# EAGLE design cheetah_driver_3 (EAGLE 6.5.0)
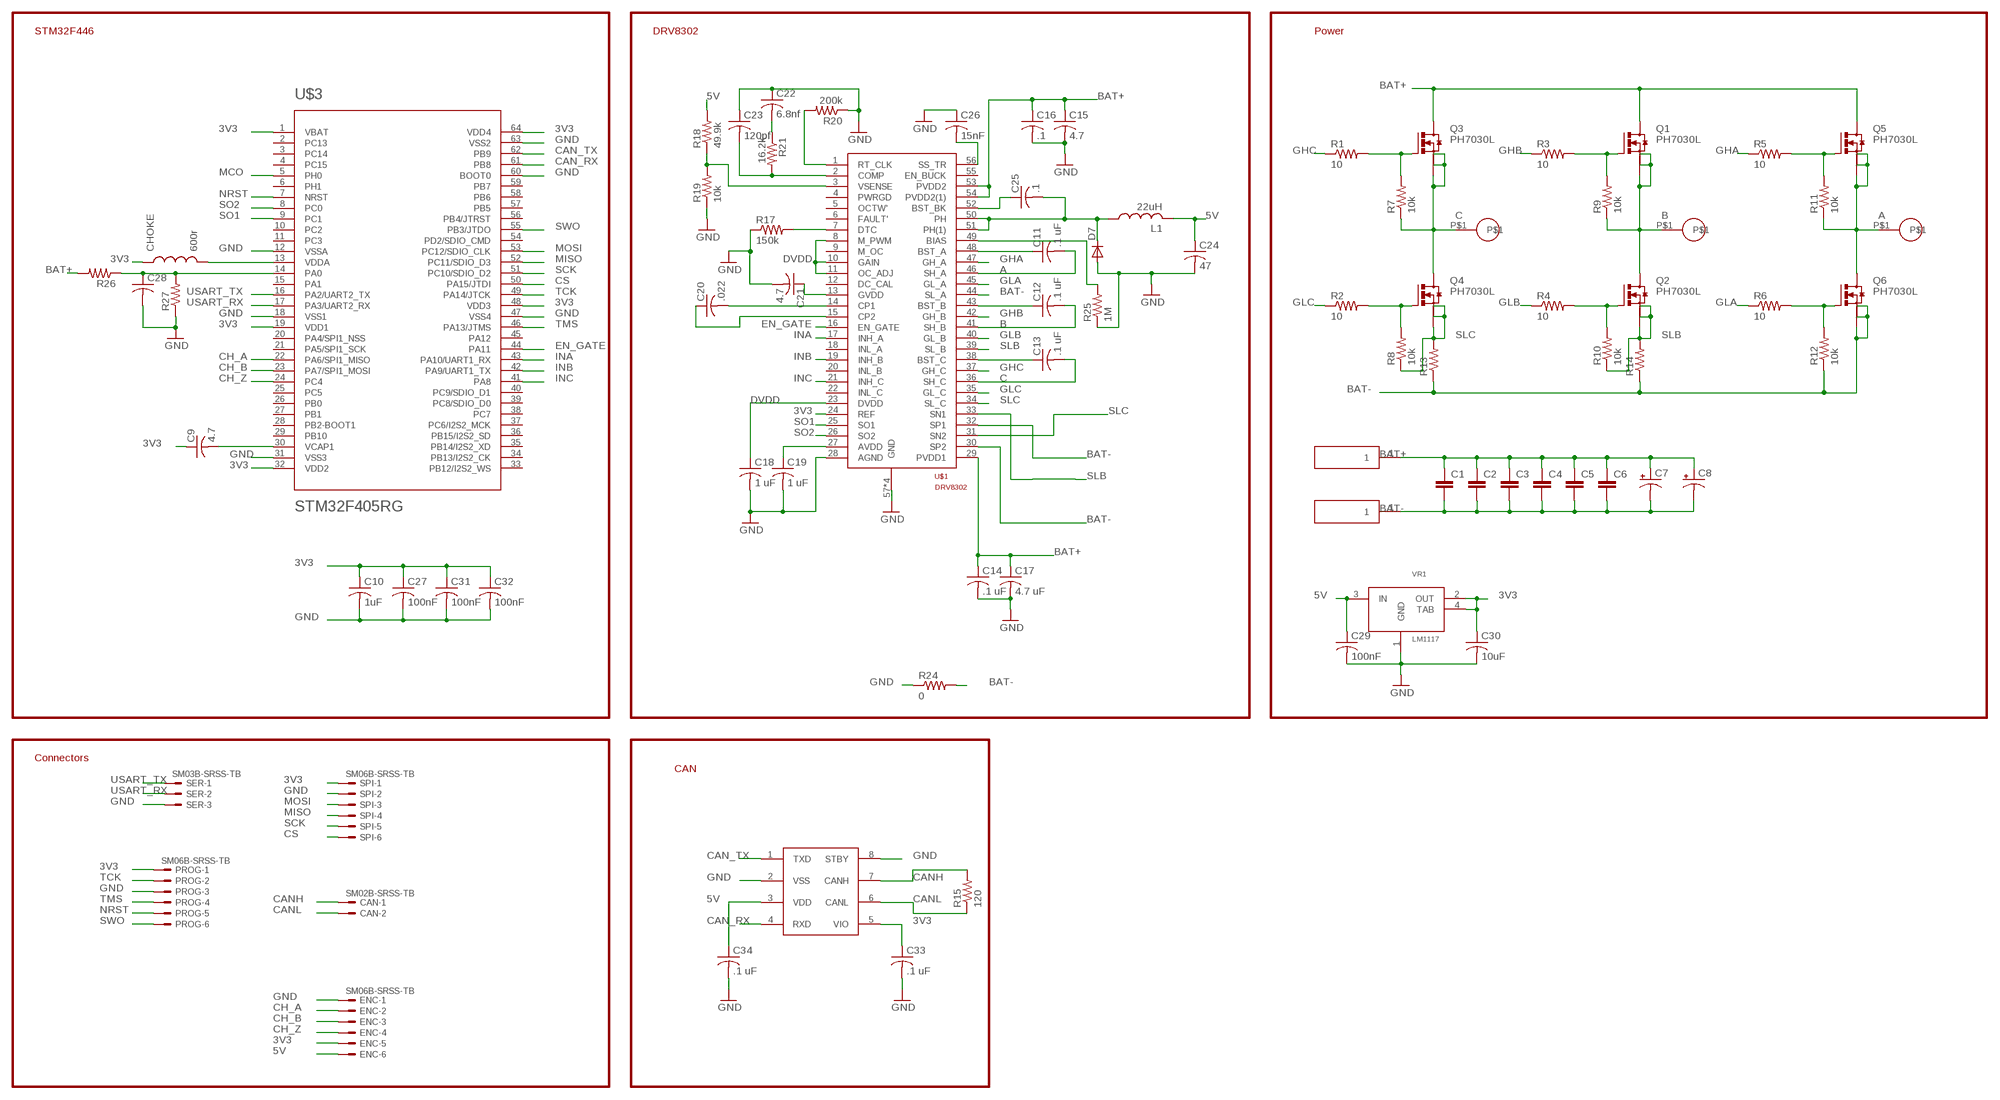
[diagram p0: schematic, sheet 1]

## Parts
C1  C-EUC0805  [C0805]
C2  C-EUC0805  [C0805]
C3  C-EUC0805  [C0805]
C4  C-EUC0805  [C0805]
C5  C-EUC0805  [C0805]
C6  C-EUC0805  [C0805]
C7  CPOL-USE3.5-8  [E3,5-8]
C8  CPOL-USE3.5-8  [E3,5-8]
C9  4.7  C-USC0603  [C0603]
C10  1uF  C-USC0603  [C0603]
C11  .1 uF  C-USC0603  [C0603]
C12  .1 uF  C-USC0603  [C0603]
C13  .1 uF  C-USC0603  [C0603]
C14  .1 uF  C-USC0603  [C0603]
C15  4.7  C-USC0805  [C0805]
C16  .1  C-USC0603  [C0603]
C17  4.7 uF  C-USC0805  [C0805]
C18  1 uF  C-USC0603  [C0603]
C19  1 uF  C-USC0603  [C0603]
C20  .022  C-USC0603  [C0603]
C21  4.7  C-USC0805  [C0805]
C22  6.8nf  C-USC0603  [C0603]
C23  120pf  C-USC0603  [C0603]
C24  47  C-USC1210  [C1210]
C25  .1  C-USC0603  [C0603]
C26  15nF  C-USC0603  [C0603]
C27  100nF  C-USC0603  [C0603]
C28  C-USC0603  [C0603]
C29  100nF  C-USC0603  [C0603]
C30  10uF  C-USC0603  [C0603]
C31  100nF  C-USC0603  [C0603]
C32  100nF  C-USC0603  [C0603]
C33  .1 uF  C-USC0603K  [C0603K]
C34  .1 uF  C-USC0603K  [C0603K]
CAN  SM02B-SRSS-TB  [SM02B-SRSS-TB]
CHOKE  600r  INDUCTOR0603  [0603]
D7  DIODE-DO-214AC  [DO-214AC]
ENC  SM06B-SRSS-TB  [SM06B-SRSS-TB]
J4  0.125_PAD  [0.125_PAD]
J5  0.125_PAD  [0.125_PAD]
L1  22uH  L-USL4532P  [L4532P]
PROG  SM06B-SRSS-TB  [SM06B-SRSS-TB]
Q1  PH7030L  [SOT669]
Q2  PH7030L  [SOT669]
Q3  PH7030L  [SOT669]
Q4  PH7030L  [SOT669]
Q5  PH7030L  [SOT669]
Q6  PH7030L  [SOT669]
R1  10  R-US_R0603  [R0603]
R2  10  R-US_R0603  [R0603]
R3  10  R-US_R0603  [R0603]
R4  10  R-US_R0603  [R0603]
R5  10  R-US_R0603  [R0603]
R6  10  R-US_R0603  [R0603]
R7  10k  R-US_R0603  [R0603]
R8  10k  R-US_R0603  [R0603]
R9  10k  R-US_R0603  [R0603]
R10  10k  R-US_R0603  [R0603]
R11  10k  R-US_R0603  [R0603]
R12  10k  R-US_R0603  [R0603]
R13  R-US_R1210  [R1210]
R14  R-US_R1210  [R1210]
R15  120  R-US_R0603  [R0603]
R17  150k  R-US_R0603  [R0603]
R18  49.9k  R-US_R0603  [R0603]
R19  10k  R-US_R0603  [R0603]
R20  200k  R-US_R0603  [R0603]
R21  16.2k  R-US_R0603  [R0603]
R24  0  R-US_R0603  [R0603]
R25  1M  R-US_R0603  [R0603]
R26  R-US_R0603  [R0603]
R27  R-US_R0603  [R0603]
SER  SM03B-SRSS-TB  [SM03B-SRSS-TB]
SPI  SM06B-SRSS-TB  [SM06B-SRSS-TB]
U$1  DRV8302  [HTSSOP56]
U$2  18_AWG_PAD  [18_AWG_PAD]
U$3  STM32F405RG  [TQFP64]
U$4  18_AWG_PAD  [18_AWG_PAD]
U$5  18_AWG_PAD  [18_AWG_PAD]
U$6  MCP2561  [SO08]
VR1  LM1117  [SOT-223]

## Nets
3V3: C9.1 C10.1 C27.1 C30.1 C31.1 C32.1 C33.1 CHOKE.1 ENC.5 PROG.1 SPI.1 U$1.24(REF) U$3.1(VBAT) U$3.19(VDD1) U$3.32(VDD2) U$3.48(VDD3) U$3.64(VDD4) U$6.5(VIO) VR1.2(OUT) VR1.4(TAB)
5V: C24.1 C29.1 C34.1 ENC.6 L1.2 R18.2 U$6.3(VDD) VR1.3(IN)
A: C11.2 Q5.1(S) Q5.2(S) Q5.3(S) Q6.MB(D) R11.1 U$1.46(SH_A) U$5.P$1
B: C12.2 Q1.1(S) Q1.2(S) Q1.3(S) Q2.MB(D) R9.1 U$1.41(SH_B) U$4.P$1
BAT+: C1.1 C2.1 C3.1 C4.1 C5.1 C6.1 C7.+ C8.+ C14.1 C15.1 C16.1 C17.1 J4.1 Q1.MB(D) Q3.MB(D) Q5.MB(D) R26.2 U$1.29(PVDD1) U$1.53(PVDD2) U$1.54(PVDD2(1))
BAT-: C1.2 C2.2 C3.2 C4.2 C5.2 C6.2 C7.- C8.- J5.1 Q6.1(S) Q6.2(S) Q6.3(S) R12.1 R13.1 R14.1 R24.2 U$1.30(SP2) U$1.32(SP1) U$1.44(SL_A)
C: C13.2 Q3.1(S) Q3.2(S) Q3.3(S) Q4.MB(D) R7.1 U$1.36(SH_C) U$2.P$1
CAN_RX: U$3.61(PB8) U$6.4(RXD)
CAN_TX: U$3.62(PB9) U$6.1(TXD)
CANH: CAN.1 R15.2 U$6.7(CANH)
CANL: CAN.2 R15.1 U$6.6(CANL)
CH_A: ENC.2 U$3.22(PA6/SPI1_MISO)
CH_B: ENC.3 U$3.23(PA7/SPI1_MOSI)
CH_Z: ENC.4 U$3.24(PC4)
CS: SPI.6 U$3.50(PA15/JTDI)
DVDD: C18.1 U$1.8(M_PWM) U$1.10(GAIN) U$1.11(OC_ADJ) U$1.23(DVDD)
EN_GATE: U$1.16(EN_GATE) U$3.44(PA11)
GHA: R5.1 U$1.47(GH_A)
GHB: R3.1 U$1.42(GH_B)
GHC: R1.1 U$1.37(GH_C)
GLA: R6.1 U$1.45(GL_A)
GLB: R4.1 U$1.40(GL_B)
GLC: R2.1 U$1.35(GL_C)
GND: C10.2 C14.2 C15.2 C16.2 C17.2 C18.2 C19.2 C21.2 C22.1 C23.1 C24.2 C26.1 C27.2 C28.2 C29.2 C30.2 C31.2 C32.2 C33.2 C34.2 D7.A ENC.1 PROG.3 R17.1 R19.1 R20.1 R24.1 R25.1 R27.1 SER.3 SPI.2 U$1.28(AGND) U$1.57(GND) U$1.P$1(GND) U$1.P$2(GND) U$1.P$3(GND) U$3.12(VSSA) U$3.18(VSS1) U$3.31(VSS3) U$3.47(VSS4) U$3.60(BOOT0) U$3.63(VSS2) U$6.2(VSS) U$6.8(STBY) VR1.1(GND)
INA: U$1.17(INH_A) U$3.43(PA10/UART1_RX)
INB: U$1.19(INH_B) U$3.42(PA9/UART1_TX)
INC: U$1.21(INH_C) U$3.41(PA8)
MCO: U$3.5(PH0)
MISO: SPI.4 U$3.52(PC11/SDIO_D3)
MOSI: SPI.3 U$3.53(PC12/SDIO_CLK)
N$1: Q3.4(G) R1.2 R7.2
N$2: CHOKE.2 U$3.13(VDDA)
N$3: C9.2 U$3.30(VCAP1)
N$4: C11.1 U$1.48(BST_A)
N$5: R25.2 U$1.49(BIAS)
N$6: C13.1 U$1.38(BST_C)
N$7: Q4.4(G) R2.2 R8.2
N$8: Q1.4(G) R3.2 R9.2
N$9: C12.1 U$1.43(BST_B)
N$10: Q5.4(G) R5.2 R11.2
N$11: Q6.4(G) R6.2 R12.2
N$12: R18.1 R19.2 U$1.3(VSENSE)
N$13: R17.2 U$1.7(DTC)
N$14: C19.1 U$1.27(AVDD)
N$15: C20.2 U$1.14(CP1)
N$16: C20.1 U$1.15(CP2)
N$17: C21.1 U$1.13(GVDD)
N$18: C23.2 R21.2 U$1.2(COMP)
N$19: R20.2 U$1.1(RT_CLK)
N$20: C22.2 R21.1
N$21: C25.2 D7.C L1.1 U$1.50(PH) U$1.51(PH(1))
N$22: C25.1 U$1.52(BST_BK)
N$23: C26.2 U$1.56(SS_TR)
N$24: C28.1 R26.1 R27.2 U$3.14(PA0)
N$27: Q2.4(G) R4.2 R10.2
NRST: PROG.5 U$3.7(NRST)
SCK: SPI.5 U$3.51(PC10/SDIO_D2)
SLB: Q2.1(S) Q2.2(S) Q2.3(S) R10.1 R14.2 U$1.33(SN1) U$1.39(SL_B)
SLC: Q4.1(S) Q4.2(S) Q4.3(S) R8.1 R13.2 U$1.31(SN2) U$1.34(SL_C)
SO1: U$1.25(SO1) U$3.9(PC1)
SO2: U$1.26(SO2) U$3.8(PC0)
SWO: PROG.6 U$3.55(PB3/JTDO)
TCK: PROG.2 U$3.49(PA14/JTCK)
TMS: PROG.4 U$3.46(PA13/JTMS)
USART_RX: SER.2 U$3.17(PA3/UART2_RX)
USART_TX: SER.1 U$3.16(PA2/UART2_TX)
Unconnected: U$1.4(PWRGD) U$1.5(OCTW') U$1.6(FAULT') U$1.9(M_OC) U$1.12(DC_CAL) U$1.18(INL_A) U$1.20(INL_B) U$1.22(INL_C) U$1.55(EN_BUCK) U$3.2(PC13) U$3.3(PC14) U$3.4(PC15) U$3.6(PH1) U$3.10(PC2) U$3.11(PC3) U$3.15(PA1) U$3.20(PA4/SPI1_NSS) U$3.21(PA5/SPI1_SCK) U$3.25(PC5) U$3.26(PB0) U$3.27(PB1) U$3.28(PB2-BOOT1) U$3.29(PB10) U$3.33(PB12/I2S2_WS) U$3.34(PB13/I2S2_CK) U$3.35(PB14/I2S2_XD) U$3.36(PB15/I2S2_SD) U$3.37(PC6/I2S2_MCK) U$3.38(PC7) U$3.39(PC8/SDIO_D0) U$3.40(PC9/SDIO_D1) U$3.45(PA12) U$3.54(PD2/SDIO_CMD) U$3.56(PB4/JTRST) U$3.57(PB5) U$3.58(PB6) U$3.59(PB7)

## Notes on the sheet
- STM32F446 | DRV8302 | Power
- Connectors
- CAN

## Library data of the parts
C1-C6 = rcl:C-EU: CAPACITOR, European symbol
C7 C8 = rcl:CPOL-US: POLARIZED CAPACITOR, American symbol
C9-C34 = rcl:C-US: CAPACITOR, American symbol
CAN = con-jst2:?M02B-SRSS-TB: Disconnectable Crimp style connector, 1.0mm pitch 2 contacts
CHOKE = SparkFun-Passives:INDUCTOR: Inductors Basic Inductor/Choke - 0603 and 1206. Footprints are not proven and vary greatly between part numbers. INDUCTOR POWER 3.3UH 4.0A SMD 0.197" L x 0.197" W x 0.177" H (5.00mm x 5.00mm x 4.50mm)
D7 = diode:DIODE-: DIODE
ENC PROG SPI = con-jst2:?M06B-SRSS-TB: Disconnectable Crimp style connector, 1.0mm pitch 6 contacts
J4 J5 = sc_usercreated:0.125_PAD
L1 = rcl:L-US: INDUCTOR, American symbol
Q1-Q6 = transistor-power:PH7030L: N-channel TrenchMOS (TM) logic level FET Source: http://www.nxp.com/acrobat_download/datasheets/PH7030L_4.pdf
R1-R15 R17-R21 R24-R27 = rcl:R-US_: RESISTOR, American symbol
SER = con-jst2:?M03B-SRSS-TB: Disconnectable Crimp style connector, 1.0mm pitch 3 contacts
U$1 = ASL (1):DRV8302
U$2 U$4 U$5 = BenLibrary:18_AWG_PAD
U$3 = BenLibrary:STM32F405RG: ARM DSP Chip used on the WAV Trigger board.
U$6 = BenLibrary:MCP2561
VR1 = sc_usercreated:LM1117

## Board
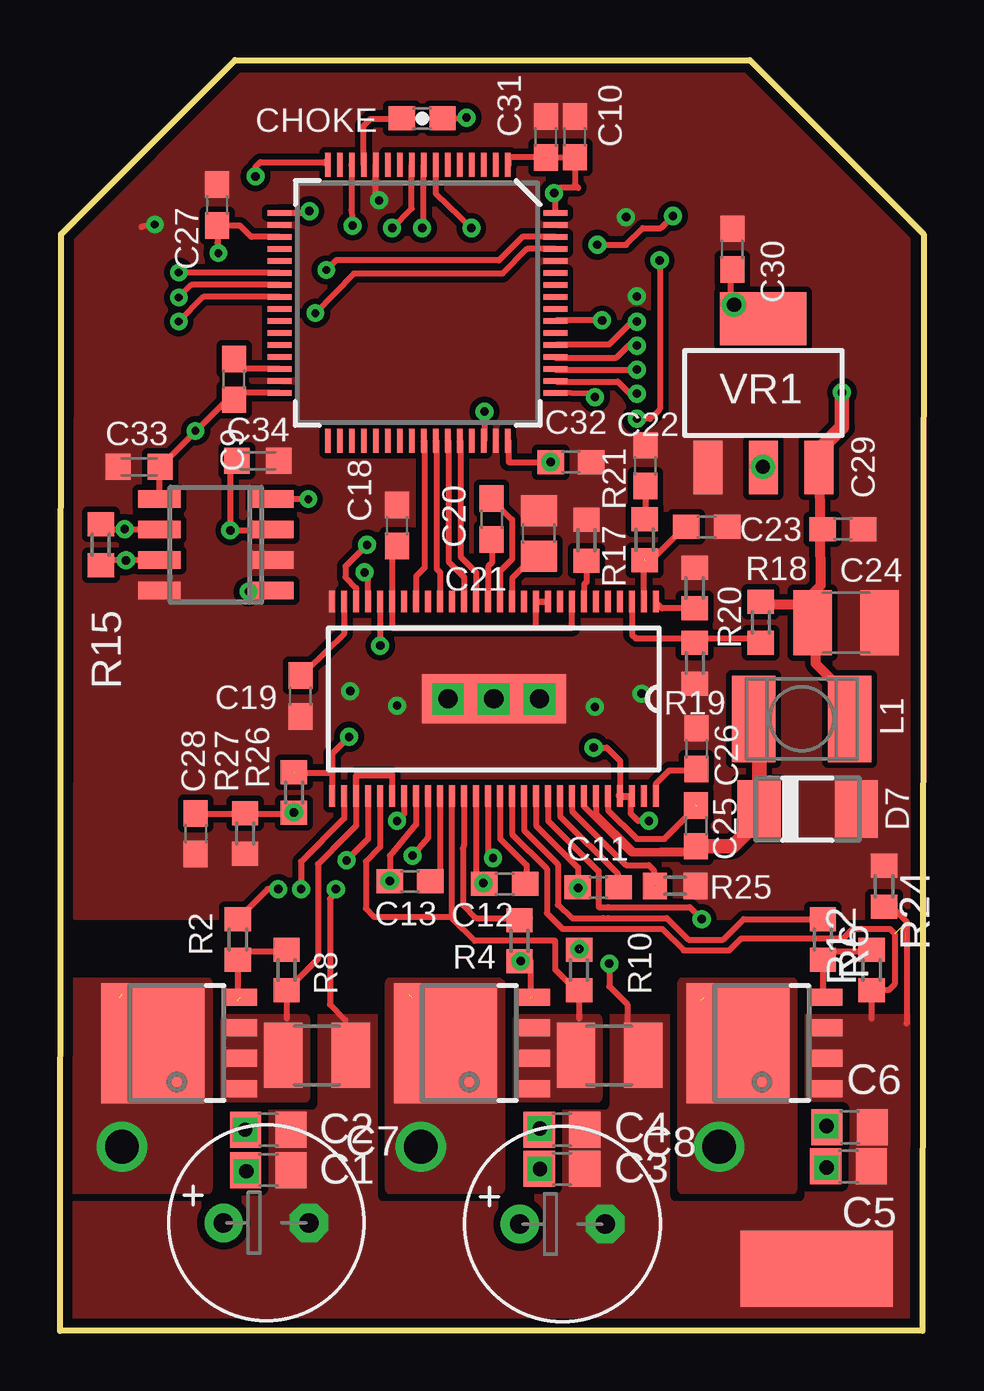
[diagram p1: board, top side]
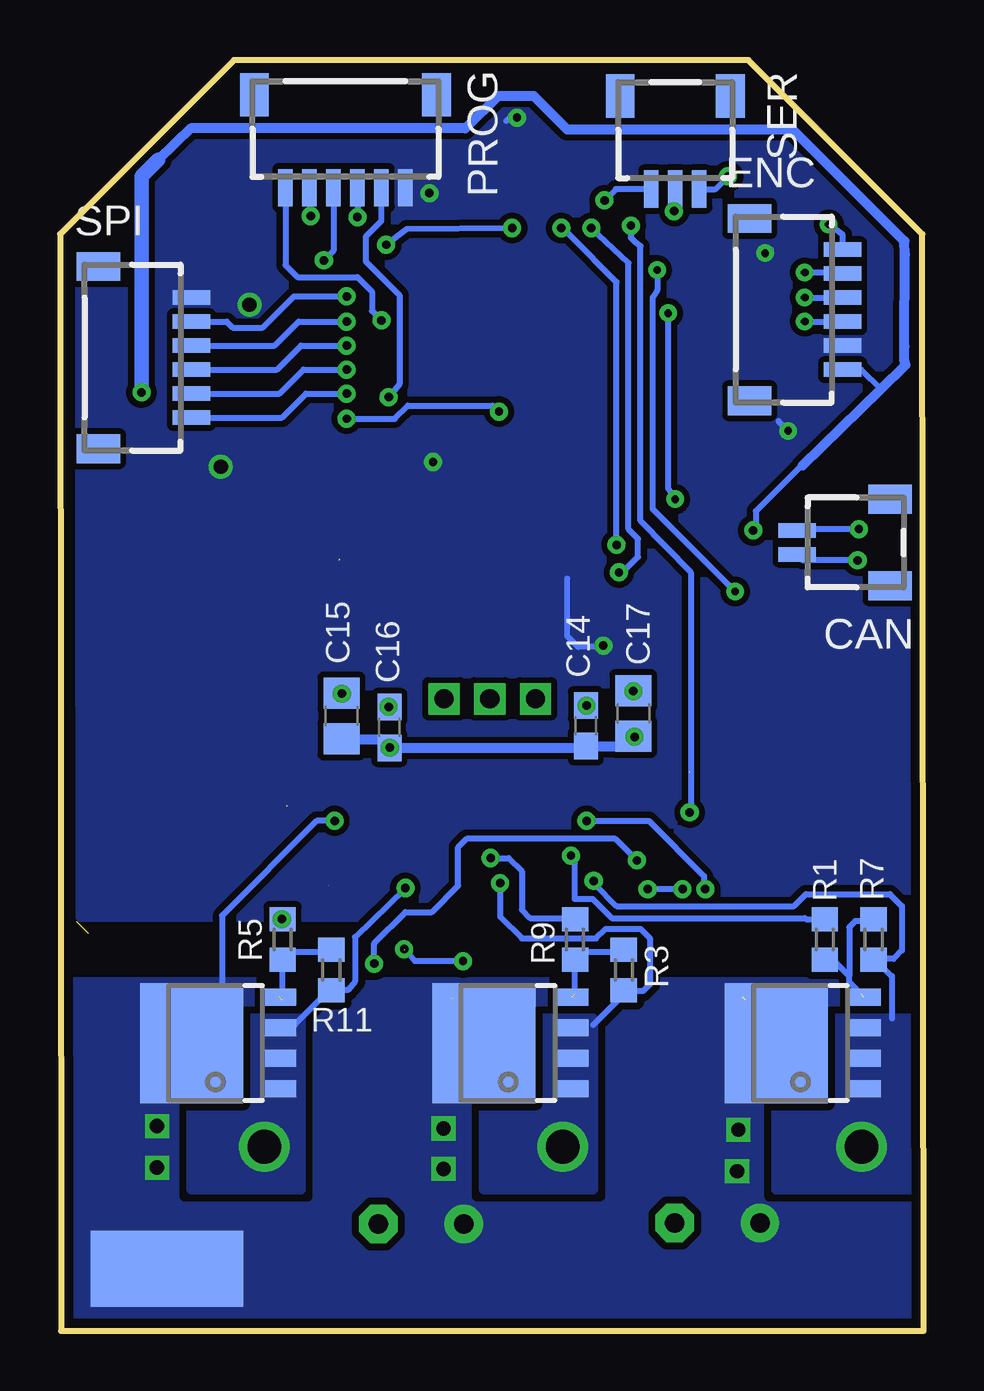
[diagram p2: board, bottom side, seen from below]

Size 36 x 52.95 mm. Coordinates in mm from the lower left corner, seen from the top.
Outline: 0,0 0.05,45.7 7.3,52.95 28.75,52.95 36,45.7 35.95,0 0,0
Copper layers (1*16): Top 0.035mm / dielectric 1.5mm / Bottom 0.035mm
Design rules "default *": minimum track width 6mil, minimum drill 24mil, track to track 6mil, track to pad 6mil, pad to pad 6mil, via to via 6mil, smd to smd 6mil, copper to edge 15mil, drill to drill 6mil, minimum pad ring 10mil, minimum via ring 8mil, stop-mask expansion 4mil, vias tented up to drill 0mil, thermal gap 10mil

### Footprints (pad centres in the part's own frame; a part is rotated, then mirrored left to right if it is on the bottom)
C0805 = smd 1.3 x 1.5: 1 -0.95,0; 2 0.95,0
E3,5-8 = drill 0.813 pad 1.6: + -1.778,0 | drill 0.813 pad 1.6 octagon: - 1.778,0
C0603 = smd 1.1 x 1: 1 -0.85,0; 2 0.85,0
C1210 = smd 1.6 x 2.7: 1 -1.4,0; 2 1.4,0
C0603K = smd 1.05 x 1.08: 1 -0.875,0; 2 0.875,0
SM02B-SRSS-TB = smd 0.6 x 1.55: 1 -0.5,2.975; 2 0.5,2.975 | smd 1.2 x 1.8: FIT@1 -1.8,-0.9; FIT@2 1.8,-0.9
0603 = smd 1.1 x 1: 1 -0.85,0; 2 0.85,0
DO-214AC = smd 1.8 x 2.4: A 2.025,0; C -2.025,0
SM06B-SRSS-TB = smd 0.6 x 1.55: 1 -2.5,2.975; 2 -1.5,2.975; 3 -0.5,2.975; 4 0.5,2.975; 5 1.5,2.975; 6 2.5,2.975 | smd 1.2 x 1.8: FIT@1 -3.8,-0.9; FIT@2 3.8,-0.9
0.125_PAD = smd 6.35 x 3.175: 1 0,0
L4532P = smd 1.8 x 3.6: 1 -2,0; 2 2,0
SOT669 = smd 0.7 x 1.4: 1 -1.905,-2.65; 2 -0.635,-2.65; 3 0.635,-2.65; 4 1.905,-2.65 | smd 5 x 4.3: MB 0,1
R0603 = smd 1 x 1.1: 1 -0.85,0; 2 0.85,0
R1210 = smd 1.6 x 2.7: 1 -1.4,0; 2 1.4,0
SM03B-SRSS-TB = smd 0.6 x 1.55: 1 -1,2.975; 2 0,2.975; 3 1,2.975 | smd 1.2 x 1.8: FIT@1 -2.3,-0.9; FIT@2 2.3,-0.9
HTSSOP56 = smd 0.9 x 0.25: 1 -4.05,6.75; 2 -4.05,6.25; 3 -4.05,5.75; 4 -4.05,5.25; 5 -4.05,4.75; 6 -4.05,4.25; 7 -4.05,3.75; 8 -4.05,3.25; 9 -4.05,2.75; 10 -4.05,2.25; 11 -4.05,1.75; 12 -4.05,1.25; 13 -4.05,0.75; 14 -4.05,0.25; 15 -4.05,-0.25; 16 -4.05,-0.75; 17 -4.05,-1.25; 18 -4.05,-1.75; 19 -4.05,-2.25; 20 -4.05,-2.75; 21 -4.05,-3.25; 22 -4.05,-3.75; 23 -4.05,-4.25; 24 -4.05,-4.75; 25 -4.05,-5.25; 26 -4.05,-5.75; 27 -4.05,-6.25; 28 -4.05,-6.75; 29 4.05,-6.75; 30 4.05,-6.25; 31 4.05,-5.75; 32 4.05,-5.25; 33 4.05,-4.75; 34 4.05,-4.25; 35 4.05,-3.75; 36 4.05,-3.25; 37 4.05,-2.75; 38 4.05,-2.25; 39 4.05,-1.75; 40 4.05,-1.25; 41 4.05,-0.75; 42 4.05,-0.25; 43 4.05,0.25; 44 4.05,0.75; 45 4.05,1.25; 46 4.05,1.75; 47 4.05,2.25; 48 4.05,2.75; 49 4.05,3.25; 50 4.05,3.75; 51 4.05,4.25; 52 4.05,4.75; 53 4.05,5.25; 54 4.05,5.75; 55 4.05,6.25; 56 4.05,6.75 | smd 2.032 x 6: 57 0,0 | drill 0.8 square: P$1 0,0; P$2 0,1.905; P$3 0,-1.905
18_AWG_PAD = drill 1.4: P$1 0,0
TQFP64 = smd 0.22 x 1: 1 -3.75,-5.75; 2 -3.25,-5.75; 3 -2.75,-5.75; 4 -2.25,-5.75; 5 -1.75,-5.75; 6 -1.25,-5.75; 7 -0.75,-5.75; 8 -0.25,-5.75; 9 0.25,-5.75; 10 0.75,-5.75; 11 1.25,-5.75; 12 1.75,-5.75; 13 2.25,-5.75; 14 2.75,-5.75; 15 3.25,-5.75; 16 3.75,-5.75; 33 3.75,5.75; 34 3.25,5.75; 35 2.75,5.75; 36 2.25,5.75; 37 1.75,5.75; 38 1.25,5.75; 39 0.75,5.75; 40 0.25,5.75; 41 -0.25,5.75; 42 -0.75,5.75; 43 -1.25,5.75; 44 -1.75,5.75; 45 -2.25,5.75; 46 -2.75,5.75; 47 -3.25,5.75; 48 -3.75,5.75 | smd 1 x 0.22: 17 5.75,-3.75; 18 5.75,-3.25; 19 5.75,-2.75; 20 5.75,-2.25; 21 5.75,-1.75; 22 5.75,-1.25; 23 5.75,-0.75; 24 5.75,-0.25; 25 5.75,0.25; 26 5.75,0.75; 27 5.75,1.25; 28 5.75,1.75; 29 5.75,2.25; 30 5.75,2.75; 31 5.75,3.25; 32 5.75,3.75; 49 -5.75,3.75; 50 -5.75,3.25; 51 -5.75,2.75; 52 -5.75,2.25; 53 -5.75,1.75; 54 -5.75,1.25; 55 -5.75,0.75; 56 -5.75,0.25; 57 -5.75,-0.25; 58 -5.75,-0.75; 59 -5.75,-1.25; 60 -5.75,-1.75; 61 -5.75,-2.25; 62 -5.75,-2.75; 63 -5.75,-3.25; 64 -5.75,-3.75
SO08 = smd 0.72 x 1.78: 1 -1.905,-2.35; 2 -0.635,-2.35; 3 0.635,-2.35; 4 1.905,-2.35; 5 1.905,2.35; 6 0.635,2.35; 7 -0.635,2.35; 8 -1.905,2.35
SOT-223 = smd 1.219 x 2.235: 1 -2.311,-3.099; 2 0,-3.099; 3 2.311,-3.099 | smd 3.6 x 2.2: 4 0,3.099

### Placement (x,y rotation side)
C1  8.69,6.7 0 top
C2  8.69,8.38 0 top
C3  20.93,6.75 0 top
C4  20.93,8.38 0 top
C5  32.87,6.85 0 top
C6  32.92,8.48 0 top
C7  8.6,4.5 0 top
C8  20.95,4.45 0 top
C9  7.25,39.64 90 top
C10  21.46,49.75 90 top
C11  22.44,18.48 180 top
C12  18.54,18.63 180 top
C13  14.59,18.73 180 top
C14  14.08,25.21 90 bottom
C15  24.26,25.62 90 bottom
C16  22.27,25.14 90 bottom
C17  12.1,25.72 90 bottom
C18  14.06,33.55 90 top
C19  10.02,26.45 270 top
C20  18,33.82 90 top
C21  19.96,33.22 90 top
C22  24.4,36.05 270 top
C23  26.96,33.5 180 top
C24  32.77,29.5 0 top
C25  26.52,21.04 270 top
C26  26.54,24.26 270 top
C27  6.56,46.91 90 top
C28  5.66,20.71 270 top
C29  32.63,33.4 0 top
C30  28.03,45.07 90 top
C31  20.25,49.74 90 top
C32  21.3,36.19 0 top
C33  3.3,36 180 top
C34  8.25,36.25 0 top
CAN  2.3,32.85 90 bottom
CHOKE  15.1,50.52 180 top
D7  31.17,21.73 0 top
ENC  6.35,42.55 270 bottom
J4  31.55,2.59 180 bottom
J5  31.55,2.59 180 top
L1  30.92,25.49 0 top
PROG  24.1,50.6 180 bottom
Q1  17.32,11.99 90 bottom
Q2  17.07,11.99 90 top
Q3  5.13,11.99 90 bottom
Q4  4.88,11.99 90 top
Q5  29.51,11.99 90 bottom
Q6  29.26,11.99 90 top
R1  4.11,16.31 270 bottom
R2  7.42,16.31 270 top
R3  14.53,16.31 270 bottom
R4  19.16,16.26 270 top
R5  26.72,16.31 270 bottom
R6  31.8,16.31 270 top
R7  2.08,16.31 90 bottom
R8  9.45,15.04 90 top
R9  12.5,15.04 90 bottom
R10  21.64,15.04 90 top
R11  24.69,15.04 90 bottom
R12  33.83,15.04 90 top
R13  10.72,11.48 180 top
R14  22.91,11.48 180 top
R15  1.7,32.75 270 top
R17  21.95,32.94 270 top
R18  29.21,29.52 90 top
R19  26.47,27.82 90 top
R20  26.46,30.95 270 top
R21  24.38,32.96 270 top
R24  34.36,18.53 270 top
R25  25.65,18.54 180 top
R26  9.76,22.43 90 top
R27  7.72,20.72 90 top
SER  10.35,50.55 180 bottom
SPI  33.5,40.55 270 bottom
U$1  18.08,26.33 270 top
U$2  2.59,7.67 0 top
U$3  14.91,42.83 180 top
U$4  15.04,7.67 0 top
U$5  27.48,7.67 0 top
U$6  6.5,32.75 90 top
VR1  29.32,39.07 0 top

### Tracks (layer width: path | path; a pad name or v marks a point on that pad's centre or on a via)
3V3  (via drill 0.32, 0.35, 0.6)  (2 unrouted)
  Top 0.25: U$3.1 18.7,48.58 18.7,48.6 | U$1.24 13.35,30.38 13.35,30.35 | U$3.48 18.7,37.08 18.7,37.05 | VR1.2 29.3,35.97 v29.3,36
  Top 0.254: 18.7,37.05 18.7,36.2 v20.45,36.2 | 13.35,30.35 v13.35,28.55 | C31.1 18.7,48.9 18.7,48.6 | VR1.4 28.27,42.17 v28.1,42.75 27.95,42.9 27.95,44.1 28.03,44.18 C30.1 | CHOKE.1 16.92,50.52 v16.95,50.55 | U$6.5 4.15,35.97 C33.1 6.97,38.79 | C31.1 21.42,48.89 C10.1 21.46,47.76 PROG.1 20.82,47.62 v20.6,47.4 20.66,47.34 U$3.64 | U$3.32 7.54,39.08 C9.1 6.97,38.79 | U$3.19 7.97,45.58 7.5,46.05 C27.1 | C27.1 | C27.1 6.57,45.32 v6.6,44.9 | 6.97,38.79 6.97,38.77 v5.65,37.5
  Bottom 0.254: 13.35,28.5 14.4,28.5 14.85,28.95 14.85,31.35 | v16.95,50.55 17.25,50.55 17.4,50.4 | v20.6,47.4 20.6,47.5 20.55,47.55 | v6.6,44.9 6.45,44.8 6.35,45.05 | v5.65,37.5 6.05,37.9 5.9,37.75
  pour Bottom (isolate 0.254, no thermals): 0.7,52.3 35.2,52.3 35.15,17.25 0.65,17.25
5V  (via drill 0.35)
  Top 0.25: 32.9,25.8 32.92,25.8 L1.2 | 31.5,29.65 31.37,29.65 C24.1 | 29.2,30.35 29.21,30.35 R18.2 | 31.65,35.95 31.63,35.95 VR1.3 | C29.1 31.68,33.4 31.68,33.45
  Top 0.254: U$6.3 8.82,33.35 v7.1,33.35 7.1,35.85 C34.1
  Top 0.406: 32.8,25.9 32.8,26.5 31.5,27.8 31.5,29.65 30.9,30.25 | 30.9,30.25 29.3,30.25 29.2,30.35 | 31.65,35.95 31.68,33.45 31.7,31.05 30.9,30.25
  Top 0.61: 32.8,25.9 32.9,25.8 | VR1.3 31.63,36.68 32.6,37.65 v32.6,39.1
  Bottom 0.254: 5.05,36.05 5.1,36.05 7,34.15 7,33.45 v7.1,33.35 | ENC.6 2.61,40.05 1.79,39.23
  Bottom 0.406: 5.05,36.05 1.79,39.23 0.75,40.25 0.8,40.4 0.79,41 0.77,44.85 0.8,45.4 | 0.8,45.4 5.45,50.05 | 31.9,48.8 30.55,50.1 19.1,50.1 17.75,51.45 16.25,51.45 14.85,50.05 5.45,50.05 | 0.8,45.4 5.45,50.05
  Bottom 0.61: v32.6,39.1 32.6,48.1 31.9,48.8
A  (via drill 0.35)
  Top 0.25: 19.85,22.45 19.83,22.45 U$1.46 | C11.2 v21.6,18.45
  Top 0.254: 19.85,22.45 19.85,21.05 21.6,19.3 v21.6,18.45
  Bottom 0.25: 24.69,14.27 R11.1
  Bottom 0.254: 24.69,14.27 26.21,12.75 | v21.6,18.45 23.7,16.4 23.7,14.55 24,14.2 R11.1
  pour Top (isolate 0.305, rank 2, no thermals): 30.53,14.53 30.53,5.89 25.96,5.89 25.96,14.53
  pour Bottom (isolate 0.305, no thermals): 25.96,13 30.53,13 30.53,5.89 25.96,5.89
B  (via drill 0.35)
  Top 0.25: U$1.41 17.35,22.28 17.35,22.25 | 17.65,18.6 v17.65,18.65 17.69,18.65 C12.2
  Top 0.254: 17.35,22.4 17.35,22.25 17.35,18.9 17.65,18.6
  Bottom 0.25: R9.1
  Bottom 0.254: 12.5,14.27 R9.1 12.5,14.02 13.77,12.75 | v17.65,18.65 17.65,17.25 16.75,16.35 13.65,16.35 13.25,16.75 11.8,16.75 11.4,16.35 11.4,14.45 11.7,14.15 12.45,14.15 R9.1
  pour Top (isolate 0.305, rank 2, no thermals): 18.34,14.53 18.34,5.89 13.77,5.89 13.77,14.53
  pour Bottom (isolate 0.305, no thermals): 13.77,13 18.34,13 18.34,5.89 13.77,5.89
BAT+  (via drill 0.35, 0.6)  (1 unrouted)
  Top 0.25: U$1.29 11.35,22.28 11.35,22.35 | U$1.53 23.3,22.28 23.3,22.3 23.83,22.3 | 23.83,22.3 U$1.54 | 23.35,22.25 23.83,22.25 U$1.54 | 23.85,22.3 23.83,22.3 | 23.83,22.3 U$1.54 | C5.1 v31.95,6.8 | v31.95,8.53 C6.1 | v20.01,8.43 C4.1 | v20.01,6.75 C3.1 | v7.72,8.38 C2.1 | v7.77,6.65 C1.1
  Top 0.254: 23.85,22.25 23.35,22.25 23.35,23.75 22.8,24.3 v22.25,24.3 | v24.55,21.25 24.1,21.25 23.8,21.55 23.8,22.25 23.85,22.3 | v12.05,24.75 11.35,24.05 11.35,23.25 | 11.35,23.25 11.35,22.35 11.35,22.25 | 9.75,23.25 11.35,23.25
  Bottom 0.25: v12.05,24.75 12.1,24.75 C17.1 12.1,24.75 | 14.05,24.3 14.08,24.3 C14.1 | v22.25,24.3 C16.1 | 24.25,24.65 24.26,24.65 C15.1
  Bottom 0.254: v24.55,21.25 25.3,21.25 29.25,17.3 29.25,14.4
  Bottom 0.406: 24.25,24.65 22.6,24.65 v22.25,24.3 14.05,24.3 14,24.35 12.5,24.35 12.1,24.75
  pour Bottom (isolate 0.305, rank 2, no thermals): 0.3,14.53 35.36,14.53 35.41,-0.9 0.35,-0.65
BAT-  (via drill 0.35)  (1 unrouted)
  Top 0.25: 11.85,22.35 11.83,22.35 U$1.30 | 12.85,22.4 12.83,22.4 U$1.32 | U$1.44 18.85,22.28 18.85,22.35 | R12.1 | 34.35,17.7 34.36,17.7 R24.2
  Top 0.254: 33.83,14.27 R12.1 | R12.1 33.83,13 | 18.85,22.4 18.85,22.35 18.85,20.7 20.3,19.25 20.3,17.4 20.95,16.75 25.1,16.75 26,15.85 27.9,15.85 28.4,16.35 32.65,16.35 33.05,16.75 34.6,16.75 34.8,16.55 34.8,14.45 34.55,14.2 R12.1 | R12.1 33.8,14.2 | v22.9,15.3 22.9,14.35 23.65,13.6 23.65,12.8 | 12.85,22.4 12.85,20.5 v11.95,19.6 | 11.85,22.35 11.85,21.35 10.05,19.55 v10.05,18.4 | v11.5,18.4 11.5,18.25 11.25,18 11.25,13.6 11.9,12.95 | 34.35,17.7 34.65,17.7 35.3,17.05 35.3,12.8
  Bottom 0.254: v22.9,15.3 22.9,16.1 22.9,16.15 21.6,17.45 20.5,17.45 19.4,18.55 19.4,20.15 19.05,20.5 12.85,20.5 v11.95,19.6 | v10.05,18.4 v11.5,18.4
  pour Top (isolate 0.305, rank 3, no thermals): 0.3,13 35.36,13 35.36,-0.75 0.3,-0.75
C  (via drill 0.35)
  Top 0.25: 14.85,22.4 14.83,22.4 U$1.36 | v13.75,18.75 v13.74,18.75 C13.2
  Top 0.254: 14.85,22.4 14.85,21.1 13.75,19.8 v13.75,18.75
  Bottom 0.25: R7.1 2.1,15.46 2.1,15.5 2.08,15.5 2.08,15.54
  Bottom 0.254: 2.08,15.54 1.32,14.78 1.32,13 | v13.75,18.75 13.7,18.6 12.8,17.7 5.4,17.7 4.9,18.2 1.4,18.2 0.9,17.7 0.9,15.85 1.25,15.5 2.1,15.5
  pour Top (isolate 0.305, rank 2, no thermals): 6.15,14.53 6.15,5.89 0.3,5.89 0.3,14.53
  pour Bottom (isolate 0.305, no thermals): 6.15,13 6.15,5.89 0.3,5.89 0.3,13
CAN_RX  (via drill 0.32)
  Top 0.254: U$3.61 19.48,45.08 18.45,44.05 12.25,44.05 v10.65,42.4 | v10.35,34.65 U$6.4
  Bottom 0.254: v10.65,42.4 10.65,35.1 v10.35,34.65
CAN_TX  (via drill 0.32)
  Top 0.254: U$3.62 19.28,45.58 18.3,44.6 11.5,44.6 v11.1,44.2 | v7.85,30.8 8.81,30.8 U$6.1
  Bottom 0.254: v7.85,30.8 10.95,33.9 11.3,34.25 11.3,43.05 11.1,43.35 v11.1,44.2
CANH  (via drill 0.35)
  Top 0.254: R15.2 1.92,32.11 U$6.7 2.76,32.11 v2.75,32.1
  Bottom 0.254: v2.75,32.1 5.02,32.1 CAN.1
CANL  (via drill 0.35)
  Top 0.254: R15.1 1.92,33.38 U$6.6 2.71,33.38 v2.7,33.4
  Bottom 0.254: v2.7,33.4 5.22,33.4 CAN.2
CH_A  (via drill 0.32)
  Top 0.254: U$3.22 4.97,44.08 v4.95,44.1
  Bottom 0.254: v4.95,44.1 3.42,44.1 ENC.2
CH_B  (via drill 0.32)
  Top 0.254: U$3.23 5.48,43.58 v4.95,43.05
  Bottom 0.254: v4.95,43.05 ENC.3
CH_Z  (via drill 0.32)
  Top 0.254: U$3.24 5.98,43.08 v4.95,42.05
  Bottom 0.254: v4.95,42.05 ENC.4
CS  (via drill 0.35)
  Top 0.25: v24.05,39.05 23.75,39.05 23.25,39.55 20.7,39.55 20.7,39.58 U$3.50
  Bottom 0.254: SPI.6 26.75,38.05 25.75,39.05 v24.05,39.05
DVDD
  Top 0.25: 13.85,30.4 13.83,30.4 U$1.23 | C18.1 13.85,32.7 13.85,32.65 | U$1.10 U$1.11 19.85,30.38 19.85,30.35 | U$1.8 21.35,30.38 21.35,30.35
  Top 0.254: 13.85,30.4 13.85,30.35 | 13.85,30.35 13.85,29.3 19.85,29.3 | 19.85,29.3 19.85,30.35 19.85,30.4 20.35,30.4 | 19.85,29.3 21.35,29.3 21.35,30.35 21.35,30.4 | 13.85,32.65 13.85,30.4 | 13.85,30.4 13.85,30.35
EN_GATE
  Top 0.25: 16.7,37.05 16.66,37.05 U$3.44 | U$1.16 17.35,30.38 17.35,30.35
  Top 0.254: 16.7,37.05 16.7,32.25 17,31.95 17.05,31.9 17.35,31.6 17.35,30.35
GHA  (via drill 0.35)
  Top 0.25: 20.35,22.35 20.33,22.35 U$1.47
  Top 0.254: 20.35,22.35 20.35,21.25 22.45,19.15 22.45,17.65 22.85,17.65 26.25,17.65 v26.75,17.15
  Bottom 0.25: v26.75,17.15 R5.1
GHB  (via drill 0.35)
  Top 0.25: U$1.42 17.85,22.28 17.85,22.3
  Top 0.254: 17.85,22.35 17.85,22.3 17.85,19.95 v18.05,19.7
  Bottom 0.25: R3.1 14.55,17.16 14.55,17.2
  Bottom 0.254: v18.05,19.7 17.3,19.7 16.75,19.15 16.75,17.55 16.4,17.2 14.55,17.2
GHC  (via drill 0.35)
  Top 0.25: 15.35,22.35 15.33,22.35 U$1.37
  Top 0.254: 15.35,22.35 15.35,20.55 v14.7,19.8
  Bottom 0.25: 4.15,17.15 R1.1
  Bottom 0.254: v14.7,19.8 14.55,19.6 14.55,18 14.2,18 13.8,18 13,17.2 4.95,17.2 4.9,17.15 4.15,17.15
GLA
  Top 0.25: U$1.45 19.35,22.28 19.35,22.35 | R6.1
  Top 0.254: 19.35,22.45 19.35,22.35 19.35,20.85 20.75,19.45 20.75,17.75 21.35,17.2 22.65,17.2 22.85,17.2 25.3,17.2 26.2,16.3 27.65,16.3 28.5,17.15 31.6,17.15 R6.1 31.85,17.15
GLB
  Top 0.25: U$1.40 16.85,22.28 16.85,22.3 | 19.6,17.2 19.16,17.2 R4.1
  Top 0.254: 16.85,22.4 16.85,22.3 16.85,20.3 16.8,20.1 16.8,17.75 17.35,17.2 19.6,17.2
GLC  (via drill 0.35)
  Top 0.25: 14.35,22.4 14.33,22.4 U$1.35 | 7.4,17.15 R2.1
  Top 0.254: 14.35,22.4 14.35,21.55 v14.05,21.25 | v9.1,18.4 8.65,18.4 7.4,17.15
  Bottom 0.254: v14.05,21.25 11.45,21.25 9.15,18.95 9.15,18.45 v9.1,18.4
GND  (via drill 0.32, 0.35)
  Top 0.254: v13.3,47.1 13.16,47.24 U$3.12 | v23.6,46.4 23.6,46.25 | v3.95,46.1 3.4,46
  Bottom 0.25: C17.2 v12.1,26.65 | C14.2 v14.05,26.06 v14.05,26.05 | v22.3,26 C16.2 | v24.25,26.55 24.26,26.55 C15.2
  Bottom 0.254: SER.3 12.83,47.57 v13.3,47.1 | v24.05,43.1 26.25,43.1 27.55,41.8 28.8,41.8 29.05,42.05 SPI.2 | PROG.3 v23.6,46.4 | ENC.1 3.38,45.67 v3.95,46.1
  pour Top (isolate 0.24, no thermals): 0.65,52.3 0.65,17.25 35.35,17.25 35.35,52.3
INA
  Top 0.25: 16.2,37.05 16.16,37.05 U$3.43 | U$1.17 16.85,30.38 16.85,30.4
  Top 0.254: 16.2,37.05 16.2,32.05 16.55,31.7 16.85,31.4 16.85,30.4
INB
  Top 0.25: 15.7,37.05 15.66,37.05 U$3.42 | 15.85,30.35 15.83,30.35 U$1.19
  Top 0.254: 15.7,37.05 15.7,31.75 15.85,31.6 15.85,30.35
INC
  Top 0.25: 15.2,37.05 15.16,37.05 U$3.41 | U$1.21 14.85,30.38 14.85,30.4
  Top 0.254: 15.2,37.05 15.2,31.8 14.85,31.45 14.85,30.4
MISO  (via drill 0.35)
  Top 0.25: v24.05,41.05 23.7,41.05 23.2,40.55 20.65,40.55 20.66,40.55 U$3.52
  Bottom 0.254: v24.05,41.05 25.95,41.05 26.95,40.05 SPI.4
MOSI  (via drill 0.35)
  Top 0.25: v24.05,42.05 23.85,42.05 22.9,41.1 20.7,41.1 20.7,41.08 U$3.53
  Bottom 0.254: v24.05,42.05 26.05,42.05 27.05,41.05 SPI.3
N$1  (1 unrouted)
  Bottom 0.25: 2.08,17.07 R7.2 | 4.11,15.54 R1.2
  Bottom 0.254: 2.08,17.07 2.84,17.07 3.1,16.81 3.1,14.78 | 2.59,14.02 3.1,14.53 3.1,14.78 | 3.1,14.78 3.86,15.54 4.11,15.54
N$2
  Top 0.254: U$3.13 12.66,50.21 12.95,50.5 14.23,50.5 CHOKE.2
N$3
  Top 0.254: U$3.30 7.67,40.08 C9.2
N$4
  Top 0.25: U$1.48 20.85,22.28 20.85,22.3 | C11.1 23.25,18.48 23.25,18.5
  Top 0.254: 20.85,22.4 20.85,22.3 20.85,21.45 23.25,19.05 23.25,18.5
N$5  (1 unrouted)
  Top 0.25: U$1.49 21.35,22.28 21.35,22.35
  Top 0.254: 21.35,22.4 21.35,22.35 21.35,21.65 23.6,19.4 24.55,19.4 24.75,19.2 24.75,18.6 R25.2
N$6
  Top 0.25: 15.85,22.4 15.83,22.4 U$1.38 | 15.4,18.7 15.44,18.7 C13.1
  Top 0.254: 15.85,22.4 15.85,19.2 15.4,18.7
N$7  (1 unrouted)
  Top 0.25: R2.2 7.51,15.46 7.51,15.39 | R8.2 9.45,15.8
  Top 0.254: 9.45,15.8 7.92,15.8 7.51,15.39 7.42,15.29 7.42,13.77
N$8  (1 unrouted)
  Bottom 0.25: R9.2 12.5,15.8 | R3.2 14.53,15.6
  Bottom 0.254: 14.53,14.02 R3.2 14.53,15.6 14.53,15.8 12.5,15.8
N$9
  Top 0.25: 18.35,22.35 18.33,22.35 U$1.43 | C12.1 19.45,18.63 19.45,18.65
  Top 0.254: 18.35,22.35 18.35,20.5 19.45,19.4 19.45,18.65
N$10  (1 unrouted)
  Bottom 0.25: R11.2 24.69,15.8 | R5.2 26.72,15.5
  Bottom 0.254: 26.72,13.77 R5.2 26.72,15.5 26.72,15.54 26.72,15.8 24.69,15.8
N$11
  Top 0.25: 31.8,13.77 31.91,13.77 Q6.4 | 33.83,15.8 R12.2 | R6.2 31.8,15.6
  Top 0.254: 33.83,15.8 31.8,15.8 31.8,15.6 R6.2 31.8,13.77
N$12
  Top 0.25: U$1.3 23.85,30.38 23.85,30.4 | R19.2 26.4,28.67 26.4,28.85 | R18.1 29.2,28.65
  Top 0.254: 23.85,30.4 23.85,29 24,28.85 26.4,28.85 29,28.85 29.2,28.65
N$13
  Top 0.25: 21.85,30.35 21.83,30.35 U$1.7 | R17.2
  Top 0.254: R17.2 21.95,31.2 21.85,31.1 21.85,30.35
N$14
  Top 0.25: U$1.27 11.85,30.38 11.85,30.3 | 10.05,27.3 C19.1
  Top 0.254: 11.85,30.4 11.85,30.3 11.85,29.05 10.3,27.55 10.05,27.35 10.05,27.3
N$15
  Top 0.25: 18.35,30.35 18.33,30.35 U$1.14 | C20.2 18,34.65
  Top 0.254: 18,34.65 18.85,33.8 18.85,32.15 18.35,31.65 18.35,30.35
N$16
  Top 0.25: 17.85,30.35 17.83,30.35 U$1.15 | C20.1 18,32.95
  Top 0.254: 18,32.95 18,32 17.85,31.85 17.85,30.35
N$17
  Top 0.25: U$1.13 18.85,30.38 18.85,30.35 | C21.1 19.85,32.27 19.85,32.35
  Top 0.254: 19.95,32.45 19.85,32.35 18.85,31.35 18.85,30.35 18.85,30.3
N$18  (1 unrouted)
  Top 0.25: U$1.2 24.35,30.38 24.35,30.4 | C23.2 26.05,33.5
  Top 0.254: 24.35,30.4 24.35,32.15 24.7,32.15 26.05,33.5
N$19
  Top 0.25: U$1.1 24.85,30.38 24.85,30.35 | R20.2
  Top 0.254: R20.2 25.1,30.1 24.85,30.35
N$20
  Top 0.25: R21.1 24.35,33.81 24.35,33.8 | C22.2
  Top 0.254: C22.2 24.4,33.85 24.35,33.8
N$21
  Top 0.25: 29.15,25.55 28.92,25.55 L1.1 | U$1.50 21.85,22.28 21.85,22.35 | 22.35,22.4 22.33,22.4 U$1.51 | 23.9,20 23.9,19.9 | 26.5,20.2 C25.2 | D7.C 29.15,21.5
  Top 0.254: 22.35,22.4 22.35,21.55 23.9,20 26.1,20.05 26.5,20.2 | 21.85,22.45 21.85,22.35 21.85,21.85 23.8,19.9 23.9,19.9 26.6,19.9
  Top 0.61: 26.5,20.2 28.05,20.2 29.15,21.3 29.15,21.5 29.15,25.55 28.85,25.85
N$22  (1 unrouted)
  Top 0.25: 22.85,22.4 22.83,22.4 U$1.52
  Top 0.254: 22.85,22.4 22.85,21.7 24.05,20.5 25.2,20.5 26.55,21.85
N$23
  Top 0.25: 24.85,22.3 24.83,22.3 U$1.56 | C26.2
  Top 0.254: 24.85,22.3 24.85,22.8 25.4,23.35 26.5,23.35 C26.2
N$24  (via drill 0.35)
  Top 0.25: U$3.14 12.15,48.55 | C28.1 | R27.2 7.8,21.57 7.8,21.55 | 9.75,21.55 v9.75,21.6 v9.76,21.6 R26.1
  Top 0.254: C28.1 7.8,21.55 9.75,21.55 | 12.15,48.6 12.15,48.55 12.15,46.7 v12.2,46.05
  Bottom 0.254: v12.2,46.05 12.2,45.55 12.03,45.38 | 12.03,45.38 11.8,45.2 | v9.75,21.6 9.7,21.65 9.7,31.6 11.8,33.75 11.8,45.2 | 11.8,45.2 12.03,45.38
N$27  (via drill 0.35)  (2 unrouted)
  Top 0.25: R4.2 v19.2,15.4 19.61,15.4 19.61,15.45
  Top 0.254: 19.61,15.45 19.61,13.87
  Bottom 0.254: v19.2,15.4 21.2,15.4 v21.65,15.9
NRST  (via drill 0.35)
  Top 0.254: U$3.7 15.66,47.39 v17.15,45.95 | v22.4,45.25 23.6,45.25 24.3,45.95 25.05,45.95 v25.55,46.45
  Bottom 0.254: v17.15,45.95 21.55,45.9 v22.4,45.25 | v25.55,46.45 25.55,47.57 PROG.5
SCK  (via drill 0.35)
  Top 0.25: v24.05,40.05 20.65,40.05 U$3.51
  Bottom 0.254: v24.05,40.05 25.85,40.05 26.85,39.05 SPI.5
SLB
  Top 0.25: 13.35,22.35 13.33,22.35 U$1.33 | U$1.39 16.35,22.28 16.35,22.3 | 21.64,14.27 R10.1
  Top 0.254: 21.64,14.27 R10.1 21.64,13 | R10.1 21.5,14.2 20.65,15.05 20.65,16.25 17.3,16.25 16.35,17.2 16.35,17.25 | 16.35,17.25 16.35,22.3 16.35,22.4 | 13.35,22.35 13.35,20.15 12.75,19.55 12.75,17.6 13.1,17.25 16.35,17.25
  pour Top (isolate 0.305, no thermals): 19.1,13 22.4,13 22.4,9.7 19.1,9.7
SLC
  Top 0.25: U$1.31 12.35,22.28 12.35,22.35 | 13.85,22.3 13.83,22.3 U$1.34 | 9.45,14.27 R8.1
  Top 0.254: 9.45,14.27 R8.1 9.45,13 | 12.35,22.6 12.35,23.15 | 12.35,23.15 12.35,22.6 | 12.35,22.6 12.35,22.5 | 12.35,22.5 12.35,22.6 | 12.35,22.6 12.35,23.15 | 12.35,23.15 13.85,23.15 13.85,22.3 | 12.35,22.5 12.35,22.35 12.35,21.05 11.95,20.65 10.75,19.45 10.75,15.5 R8.1
  pour Top (isolate 0.305, no thermals): 6.91,13 10.21,13 10.21,9.7 6.91,9.7
SO1  (via drill 0.35)
  Top 0.25: 12.85,30.4 12.83,30.4 U$1.25
  Top 0.254: 12.85,30.4 12.85,31.45 v12.7,31.6 | v13.85,45.95 14.66,46.76 U$3.9
  Bottom 0.254: v12.7,31.6 12.55,31.6 11.9,32.25 11.9,33 12.3,33.4 12.3,44.5 v13.85,45.95
SO2  (via drill 0.35)
  Top 0.25: 15.16,48.6 U$3.8 | U$1.26 12.35,30.38 12.35,30.4
  Top 0.254: v12.8,32.75 12.65,32.6 11.9,31.85 11.9,31.4 12.35,30.95 12.35,30.4 12.35,30.35 | v15.1,45.95 15.16,45.96 U$3.8
  Bottom 0.254: v12.8,32.75 12.8,43.7 14.75,45.65 v15.1,45.95
SWO  (via drill 0.35)
  Top 0.254: v22.6,42.1 20.69,42.1 U$3.55
  Bottom 0.254: PROG.6 26.6,44.4 26.1,43.9 23.6,43.9 23,43.3 23,42.5 v22.6,42.1
TCK  (via drill 0.35)
  Top 0.254: v22.3,38.9 21.99,39.05 U$3.49
  Bottom 0.254: v22.3,38.9 21.85,39.45 21.85,43.15 22.6,43.9 23.25,44.55 23.25,45.6 22.6,46.25 PROG.2
TMS  (via drill 0.35)
  Top 0.254: v25,44.6 25,38.4 24.6,38 v24.05,38 | v17.7,38.3 17.7,37.11 U$3.46
  Bottom 0.254: PROG.4 24.6,45 v25,44.6 | v24.05,38 22.05,38 21.5,38.55 17.95,38.55 v17.7,38.3
USART_RX  (via drill 0.35)
  Top 0.254: U$3.17 10.33,46.58 v10.4,46.65
  Bottom 0.254: v10.4,46.65 10.4,47.52 SER.2
USART_TX  (via drill 0.35)
  Top 0.254: v8.15,48.1 8.15,48.5 8.35,48.7 11.04,48.7 U$3.16
  Bottom 0.254: SER.1 8.68,47.57 v8.15,48.1